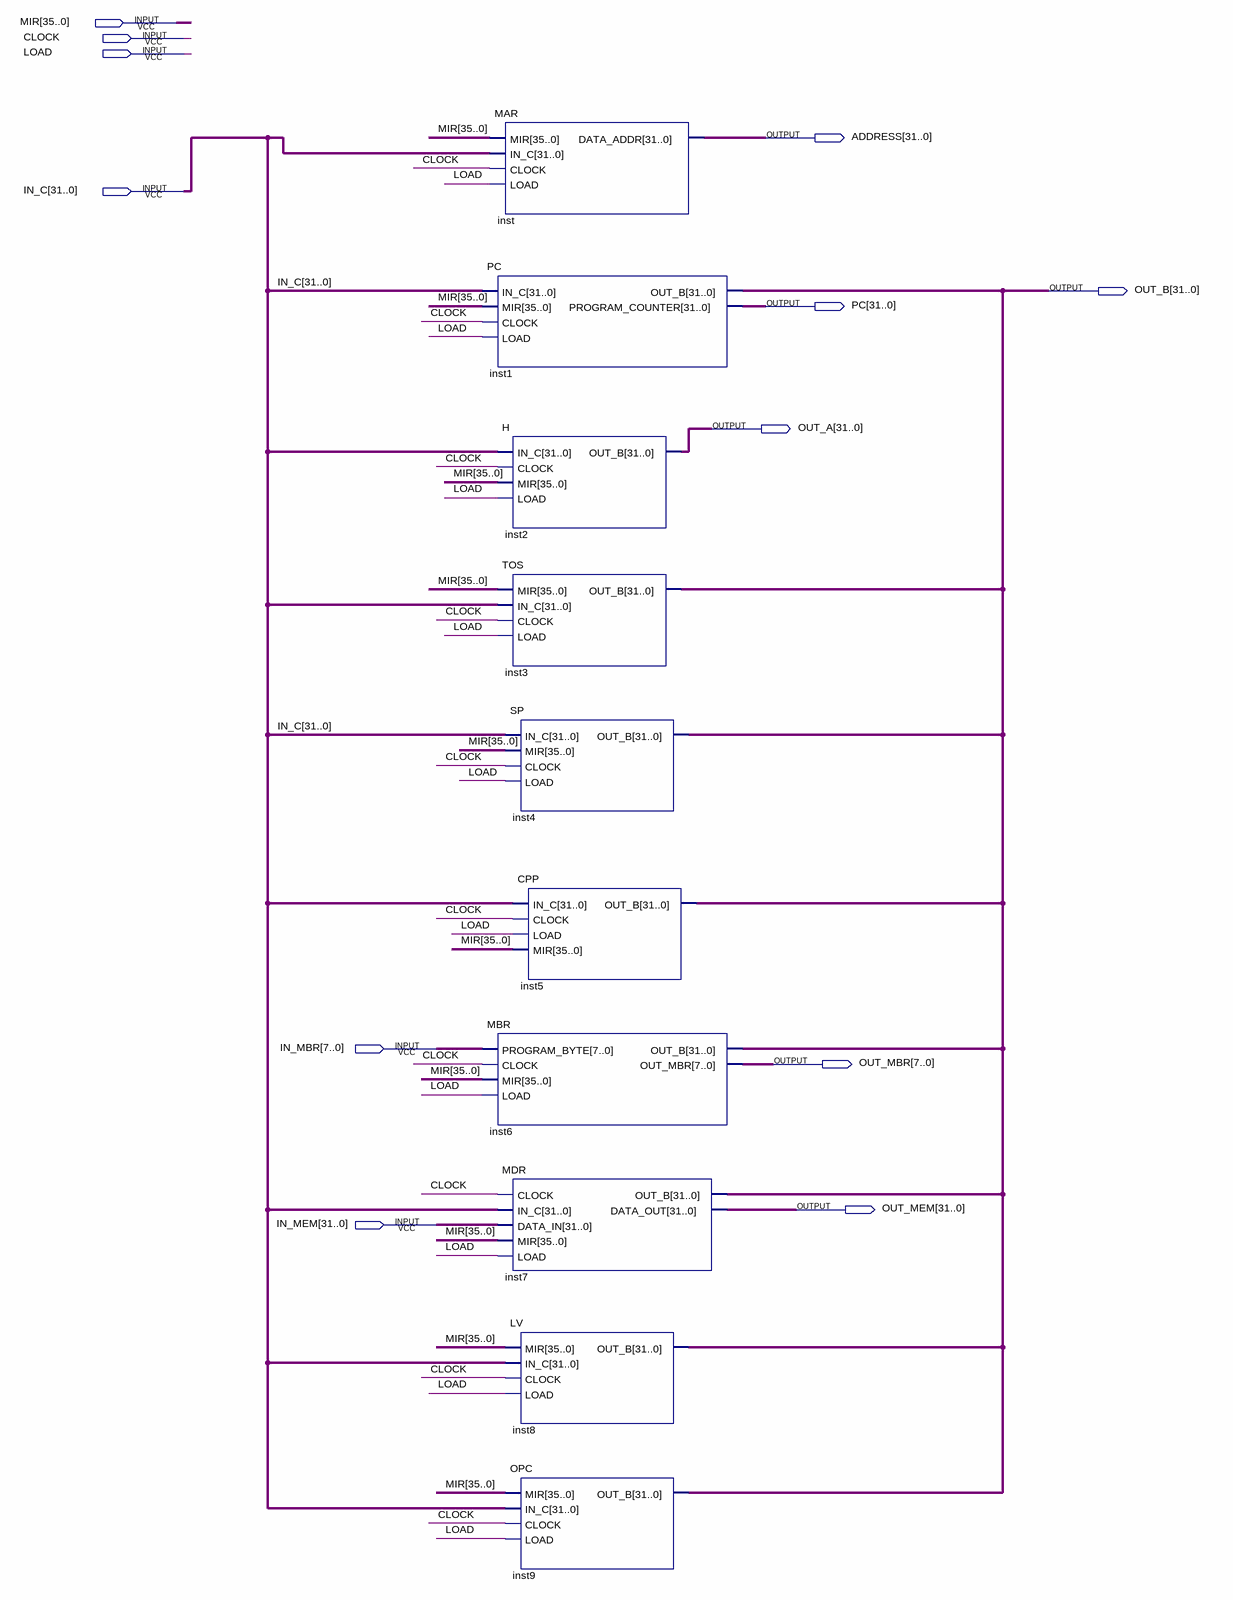
[diagram p0: schematic sheet]
// Quartus schematic REGISTER_BANK.bdf as structural Verilog: 10 symbols, 12 pins
module REGISTER_BANK (
  input  [35:0] MIR,
  input  CLOCK,
  input  LOAD,
  input  [31:0] IN_C,
  input  [7:0] IN_MBR,
  input  [31:0] IN_MEM,
  output [31:0] ADDRESS,
  output [31:0] OUT_B,
  output [31:0] PC,
  output [31:0] OUT_A,
  output [7:0] OUT_MBR,
  output [31:0] OUT_MEM
);

  MAR inst (.MIR(MIR), .IN_C(IN_C), .CLOCK(CLOCK), .LOAD(LOAD), .DATA_ADDR(ADDRESS));
  PC inst1 (.IN_C(IN_C), .MIR(MIR), .CLOCK(CLOCK), .LOAD(LOAD), .OUT_B(OUT_B), .PROGRAM_COUNTER(PC));
  H inst2 (.IN_C(IN_C), .CLOCK(CLOCK), .MIR(MIR), .LOAD(LOAD), .OUT_B(OUT_A));
  TOS inst3 (.MIR(MIR), .IN_C(IN_C), .CLOCK(CLOCK), .LOAD(LOAD), .OUT_B(OUT_B));
  SP inst4 (.IN_C(IN_C), .MIR(MIR), .CLOCK(CLOCK), .LOAD(LOAD), .OUT_B(OUT_B));
  CPP inst5 (.IN_C(IN_C), .CLOCK(CLOCK), .LOAD(LOAD), .MIR(MIR), .OUT_B(OUT_B));
  MBR inst6 (.PROGRAM_BYTE(IN_MBR), .CLOCK(CLOCK), .MIR(MIR), .LOAD(LOAD), .OUT_B(OUT_B), .OUT_MBR(OUT_MBR));
  MDR inst7 (.CLOCK(CLOCK), .IN_C(IN_C), .DATA_IN(IN_MEM), .MIR(MIR), .LOAD(LOAD), .OUT_B(OUT_B), .DATA_OUT(OUT_MEM));
  LV inst8 (.MIR(MIR), .IN_C(IN_C), .CLOCK(CLOCK), .LOAD(LOAD), .OUT_B(OUT_B));
  OPC inst9 (.MIR(MIR), .IN_C(IN_C), .CLOCK(CLOCK), .LOAD(LOAD), .OUT_B(OUT_B));
endmodule
